# Altium schematic sheet Microcontroller.SchDoc
size A3; SheetNumber: 5; SheetTotal: 7
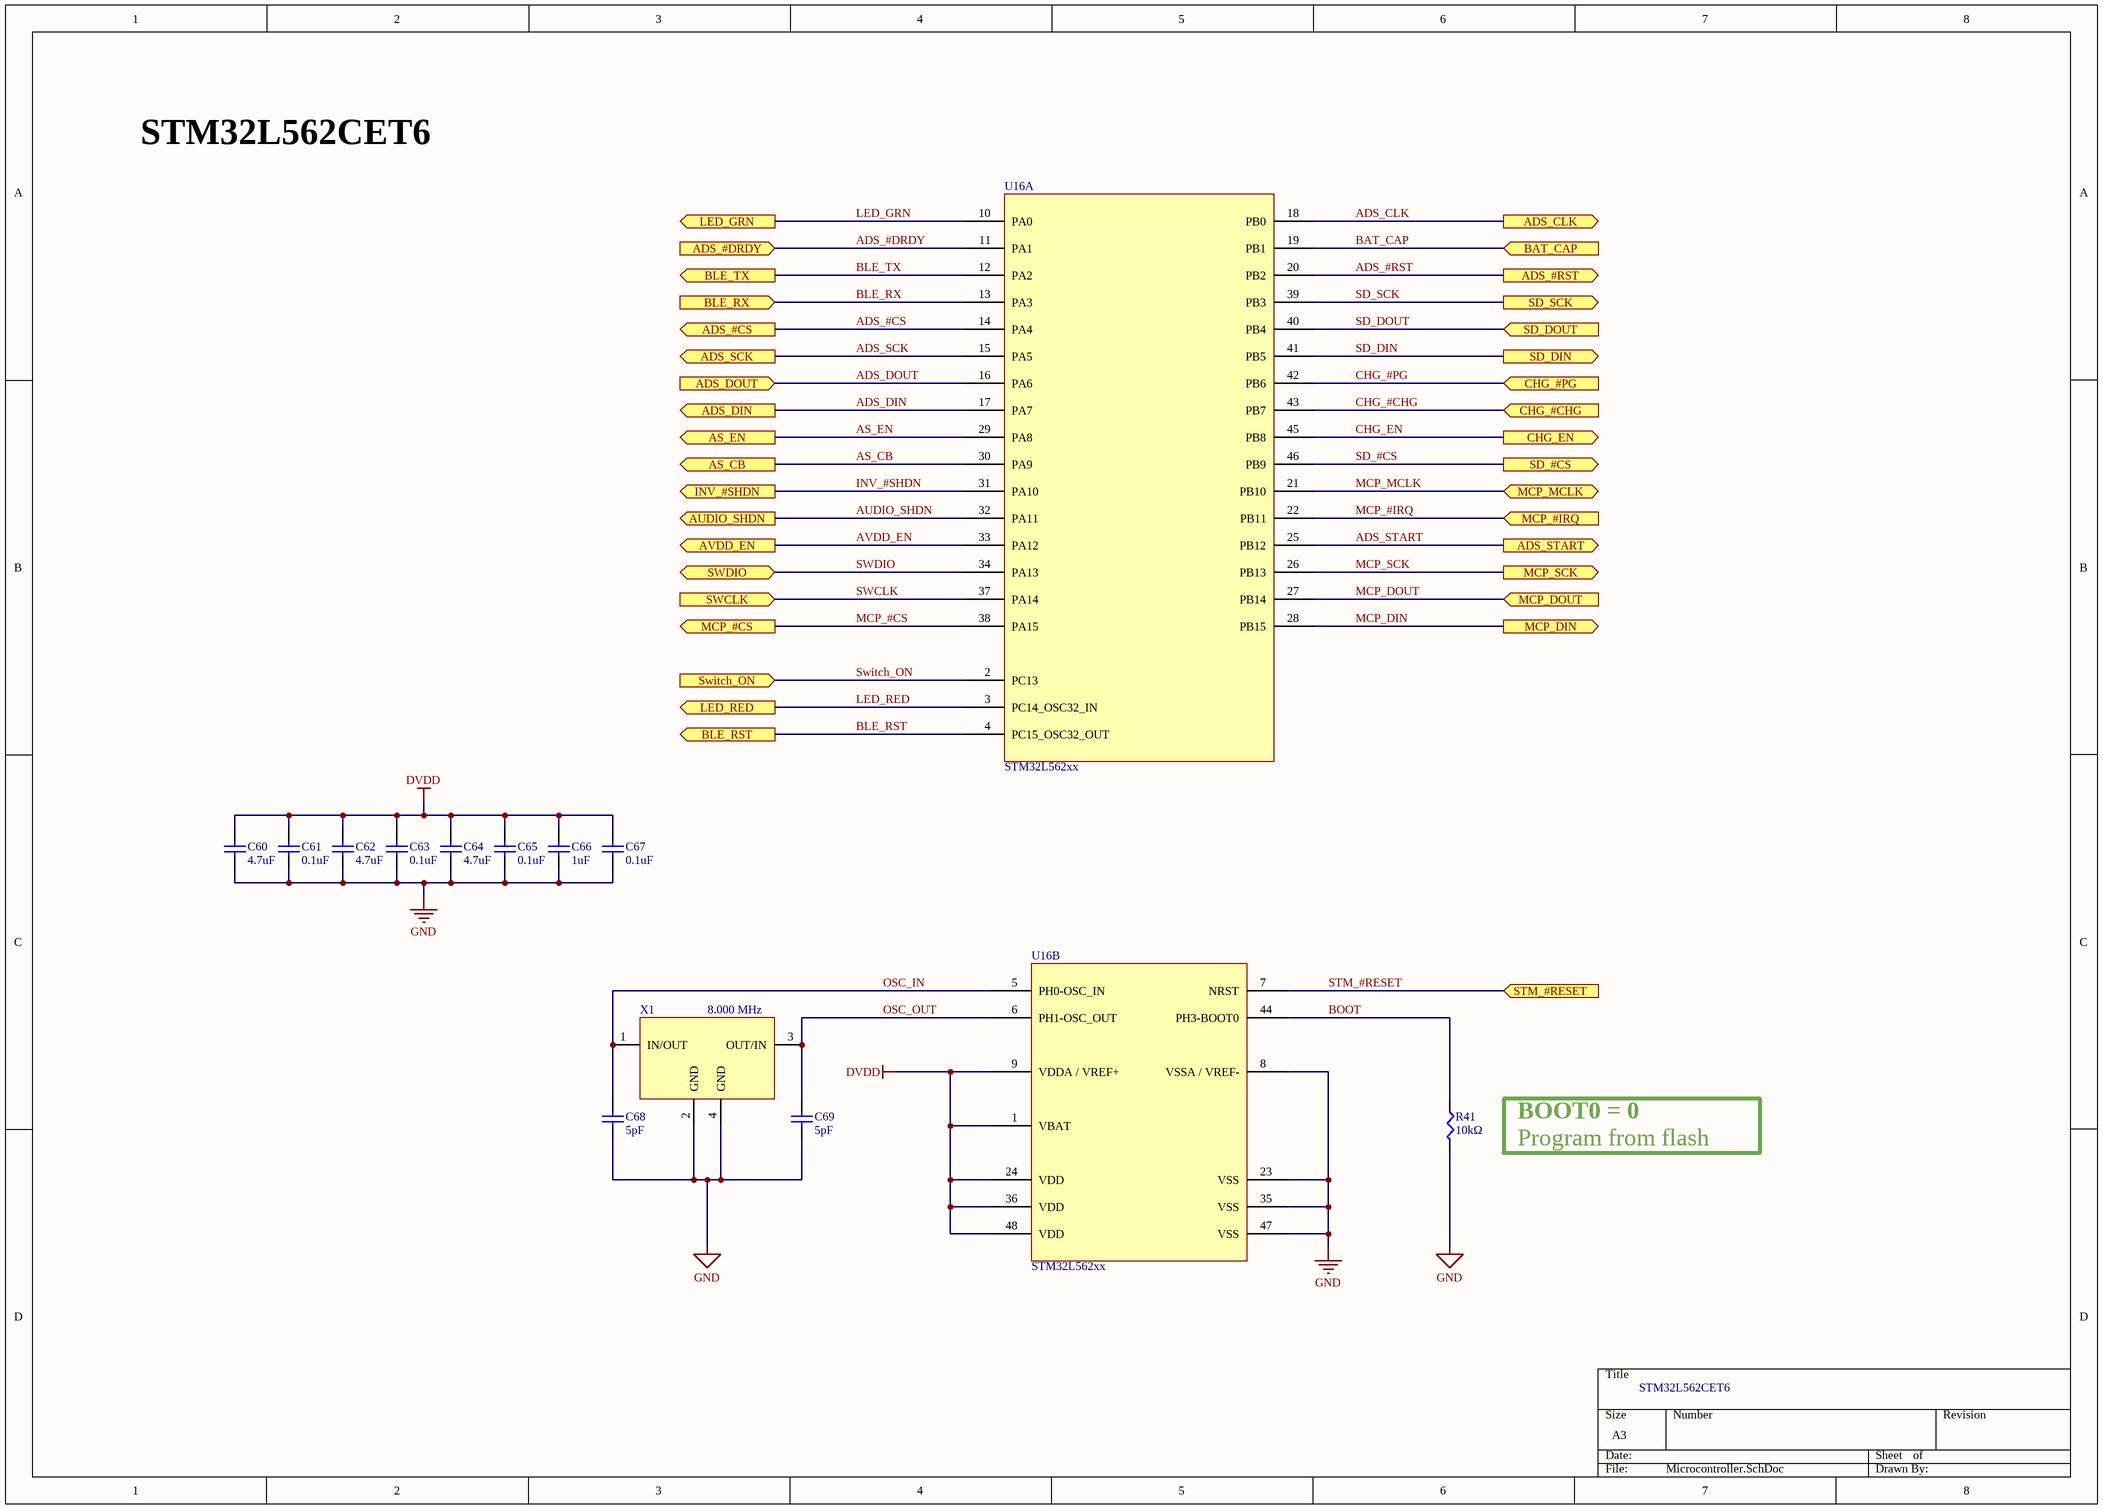
[diagram p0: Microcontroller.SchDoc]

## Parts
C60  4.7uF  [0603]
C61  0.1uF  [0402]
C62  4.7uF  [0603]
C63  0.1uF  [0402]
C64  4.7uF  [0603]
C65  0.1uF  [0402]
C66  1uF  [0402]
C67  0.1uF  [0402]
C68  5pF  [0402]
C69  5pF  [0402]
R41  10kΩ  [0402]
U16  STM32L562xx  [LQFP48]  (parts A,B of 2)
X1  8.000 MHz  [SMD-4]

## Ports
ADS_#CS (out), ADS_#DRDY (in), ADS_#RST (out), ADS_CLK (out), ADS_DIN (out), ADS_DOUT (in), ADS_SCK (out), ADS_START (out), AS_CB (out), AS_EN (out), AUDIO_SHDN (out), AVDD_EN (out), BAT_CAP (in), BLE_RST (out), BLE_RX (in), BLE_TX (out), CHG_#CHG (in), CHG_#PG (in), CHG_EN (out), INV_#SHDN (out), LED_GRN (out), LED_RED (out), MCP_#CS (out), MCP_#IRQ (in), MCP_DIN (out), MCP_DOUT (in), MCP_MCLK (bidir), MCP_SCK (out), SD_#CS (out), SD_DIN (out), SD_DOUT (in), SD_SCK (out), STM_#RESET (in), SWCLK (in), SWDIO (bidir), Switch_ON (in)

## Nets
DVDD: C60.2 C61.2 C62.2 C63.2 C64.2 C65.2 C66.2 C67.2 U16.1(VBAT) U16.9(VDDA_/_VREF+) U16.24(VDD) U16.36(VDD) U16.48(VDD)
GND: C60.1 C61.1 C62.1 C63.1 C64.1 C65.1 C66.1 C67.1 C68.1 C69.1 R41.2 U16.8(VSSA_/_VREF-) U16.23(VSS) U16.35(VSS) U16.47(VSS) X1.2(GND) X1.4(GND)
ADS_#CS: U16.14(PA4) ; port ADS_#CS
ADS_#DRDY: U16.11(PA1) ; port ADS_#DRDY
ADS_#RST: U16.20(PB2) ; port ADS_#RST
ADS_CLK: U16.18(PB0) ; port ADS_CLK
ADS_DIN: U16.17(PA7) ; port ADS_DIN
ADS_DOUT: U16.16(PA6) ; port ADS_DOUT
ADS_SCK: U16.15(PA5) ; port ADS_SCK
ADS_START: U16.25(PB12) ; port ADS_START
AS_CB: U16.30(PA9) ; port AS_CB
AS_EN: U16.29(PA8) ; port AS_EN
AUDIO_SHDN: U16.32(PA11) ; port AUDIO_SHDN
AVDD_EN: U16.33(PA12) ; port AVDD_EN
BAT_CAP: U16.19(PB1) ; port BAT_CAP
BLE_RST: U16.4(PC15_OSC32_OUT) ; port BLE_RST
BLE_RX: U16.13(PA3) ; port BLE_RX
BLE_TX: U16.12(PA2) ; port BLE_TX
BOOT: R41.1 U16.44(PH3-BOOT0)
CHG_#CHG: U16.43(PB7) ; port CHG_#CHG
CHG_#PG: U16.42(PB6) ; port CHG_#PG
CHG_EN: U16.45(PB8) ; port CHG_EN
INV_#SHDN: U16.31(PA10) ; port INV_#SHDN
LED_GRN: U16.10(PA0) ; port LED_GRN
LED_RED: U16.3(PC14_OSC32_IN) ; port LED_RED
MCP_#CS: U16.38(PA15) ; port MCP_#CS
MCP_#IRQ: U16.22(PB11) ; port MCP_#IRQ
MCP_DIN: U16.28(PB15) ; port MCP_DIN
MCP_DOUT: U16.27(PB14) ; port MCP_DOUT
MCP_MCLK: U16.21(PB10) ; port MCP_MCLK
MCP_SCK: U16.26(PB13) ; port MCP_SCK
OSC_IN: C68.2 U16.5(PH0-OSC_IN) X1.1(IN/OUT)
OSC_OUT: C69.2 U16.6(PH1-OSC_OUT) X1.3(OUT/IN)
SD_#CS: U16.46(PB9) ; port SD_#CS
SD_DIN: U16.41(PB5) ; port SD_DIN
SD_DOUT: U16.40(PB4) ; port SD_DOUT
SD_SCK: U16.39(PB3) ; port SD_SCK
STM_#RESET: U16.7(NRST) ; port STM_#RESET
SWCLK: U16.37(PA14) ; port SWCLK
SWDIO: U16.34(PA13) ; port SWDIO
Switch_ON: U16.2(PC13) ; port Switch_ON

## Notes on the sheet
- STM32L562CET6
- BOOT0 = 0
- Program from flash

## Library data of the parts
C60 C62 C64 = 0603: MLCC-0603
C61 C63 C65-C69 = 0402: MLCC-0402
R41 = 0402: Resistor_SMD_0402; AuthorBy: yjlab
U16 = STM32L562xx: STM32, 32 Bit MCU, 48 Pin, Arm Cortex-M33, 512 (kB) Flash, 256 (kB) SRAM
X1 = ECS-80-10-30B-CKM-TR: Crystals ECX-53B 8.000 MHz 10 pF